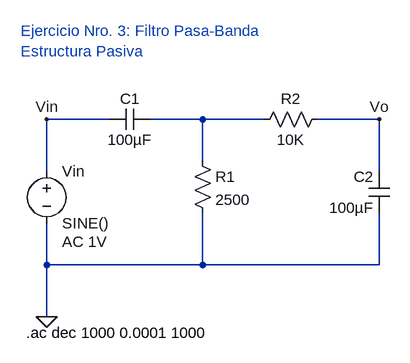
[diagram p0: schematic Ejercicio3_PasaBanda.asc]
Ejercicio3_PasaBanda.asc, the LTspice schematic file:
Version 4
SHEET 1 880 680
WIRE 64 80 -32 80
WIRE 208 80 128 80
WIRE 304 80 208 80
WIRE 480 80 384 80
WIRE 208 144 208 80
WIRE -32 160 -32 80
WIRE 480 160 480 80
WIRE -32 304 -32 240
WIRE 208 304 208 224
WIRE 208 304 -32 304
WIRE 480 304 480 224
WIRE 480 304 208 304
WIRE -32 384 -32 304
FLAG -32 384 0
FLAG -32 80 Vin
FLAG 480 80 Vo
SYMBOL cap 128 64 R90
WINDOW 0 0 32 VBottom 2
WINDOW 3 32 32 VTop 2
SYMATTR InstName C1
SYMATTR Value 100µF
SYMBOL res 192 128 R0
SYMATTR InstName R1
SYMATTR Value 2500
SYMBOL cap 496 224 R180
WINDOW 0 24 56 Left 2
WINDOW 3 24 8 Left 2
SYMATTR InstName C2
SYMATTR Value 100µF
SYMBOL res 400 64 R90
WINDOW 0 0 56 VBottom 2
WINDOW 3 32 56 VTop 2
SYMATTR InstName R2
SYMATTR Value 10K
SYMBOL voltage -32 144 R0
WINDOW 123 24 124 Left 2
WINDOW 39 0 0 Left 0
SYMATTR Value2 AC 1V
SYMATTR InstName Vin
SYMATTR Value SINE()
TEXT -64 408 Left 2 !.ac dec 1000 0.0001 1000
TEXT -72 -56 Left 2 ;Ejercicio Nro. 3: Filtro Pasa-Banda\nEstructura Pasiva

The netlist it stands for:
* Ejercicio3_PasaBanda.asc
C1 N001 Vin 100µF
R1 N001 0 2500
C2 0 Vo 100µF
R2 Vo N001 10K
Vin Vin 0 SINE() AC 1V
.ac dec 1000 0.0001 1000
* Ejercicio Nro. 3: Filtro Pasa-Banda
* Estructura Pasiva
.backanno
.end